# Altium project B302BA-PCIe.PrjPcb
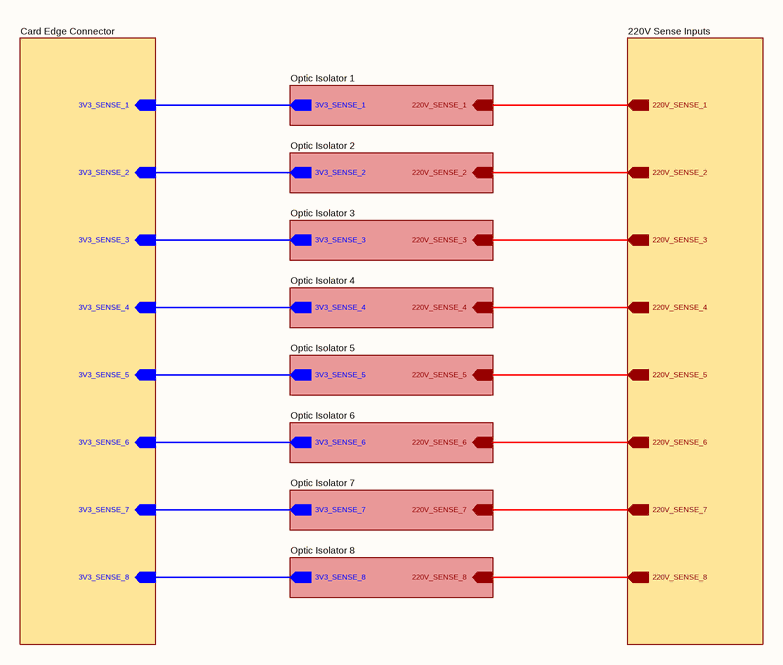
[diagram p0: Block Diagram.SchDoc]
Address1_: Buyuk Kayacik Mah. 4. OSB; Address2_: 103. Cad. No : 12; Address3_: Selcuklu / Konya; Address4_: Türkiye; Copyright_: Copyright 2022 STF Tarim (Commercial Secret); Customer_: STF Irrigation; Engineer_: Gunce Akkoyun; Git_Repo_Address_: www.github.com/akkoyun/B001AA; Module_ID_: B302AA-PCIe; Organization_: STF Res-Dev; Product_Desc_: PowerStat; Product_ID_: --; Revision_: 00.00.01; Version_: R1
11 sheets, 45 parts. Net scope: hierarchical (ports join the sheet entries above them; power ports are global).
Board file: B302BA-PCIe.PcbDoc
Sheets:
  Block Diagram.SchDoc
    Optic Isolator 1 = Opto Isolator 1.SchDoc
    Card Edge Connector = Card Edge Connector.SchDoc
    Optic Isolator 2 = Opto Isolator 2.SchDoc
    Optic Isolator 3 = Opto Isolator 3.SchDoc
    Optic Isolator 4 = Opto Isolator 4.SchDoc
    Optic Isolator 5 = Opto Isolator 5.SchDoc
    Optic Isolator 6 = Opto Isolator 6.SchDoc
    Optic Isolator 7 = Opto Isolator 7.SchDoc
    Optic Isolator 8 = Opto Isolator 8.SchDoc
  I2C IO Expander.SchDoc

## Sheet Block Diagram.SchDoc: B302AA Block Diagram
size 292 x 193 mm; SheetNumber: 1; SheetTotal: 11

### Sub-sheets
220V Sense Inputs = 220V Sense Input Socket.SchDoc (file not in this document): 220V_SENSE_2 (out), 220V_SENSE_1 (out), 220V_SENSE_5 (out), 220V_SENSE_6 (out), 220V_SENSE_3 (out), 220V_SENSE_4 (out), 220V_SENSE_7 (out), 220V_SENSE_8 (out)
Card Edge Connector = Card Edge Connector.SchDoc: 3V3_SENSE_1 (in), 3V3_SENSE_2 (in), 3V3_SENSE_3 (in), 3V3_SENSE_4 (in), 3V3_SENSE_5 (in), 3V3_SENSE_6 (in), 3V3_SENSE_8 (in), 3V3_SENSE_7 (in)
Optic Isolator 1 = Opto Isolator 1.SchDoc: 220V_SENSE_1 (in), 3V3_SENSE_1 (out)
Optic Isolator 2 = Opto Isolator 2.SchDoc: 220V_SENSE_2 (in), 3V3_SENSE_2 (out)
Optic Isolator 3 = Opto Isolator 3.SchDoc: 220V_SENSE_3 (in), 3V3_SENSE_3 (out)
Optic Isolator 4 = Opto Isolator 4.SchDoc: 220V_SENSE_4 (in), 3V3_SENSE_4 (out)
Optic Isolator 5 = Opto Isolator 5.SchDoc: 220V_SENSE_5 (in), 3V3_SENSE_5 (out)
Optic Isolator 6 = Opto Isolator 6.SchDoc: 220V_SENSE_6 (in), 3V3_SENSE_6 (out)
Optic Isolator 7 = Opto Isolator 7.SchDoc: 220V_SENSE_7 (in), 3V3_SENSE_7 (out)
Optic Isolator 8 = Opto Isolator 8.SchDoc: 220V_SENSE_8 (in), 3V3_SENSE_8 (out)

### Nets
3V3_SENSE_1: sheet Optic Isolator 1/3V3_SENSE_1, sheet Card Edge Connector/3V3_SENSE_1
3V3_SENSE_2: sheet Card Edge Connector/3V3_SENSE_2, sheet Optic Isolator 2/3V3_SENSE_2
3V3_SENSE_3: sheet Card Edge Connector/3V3_SENSE_3, sheet Optic Isolator 3/3V3_SENSE_3
3V3_SENSE_4: sheet Card Edge Connector/3V3_SENSE_4, sheet Optic Isolator 4/3V3_SENSE_4
3V3_SENSE_5: sheet Card Edge Connector/3V3_SENSE_5, sheet Optic Isolator 5/3V3_SENSE_5
3V3_SENSE_6: sheet Card Edge Connector/3V3_SENSE_6, sheet Optic Isolator 6/3V3_SENSE_6
3V3_SENSE_7: sheet Card Edge Connector/3V3_SENSE_7, sheet Optic Isolator 7/3V3_SENSE_7
3V3_SENSE_8: sheet Card Edge Connector/3V3_SENSE_8, sheet Optic Isolator 8/3V3_SENSE_8
220V_SENSE_1: sheet 220V Sense Inputs/220V_SENSE_1, sheet Optic Isolator 1/220V_SENSE_1
220V_SENSE_2: sheet 220V Sense Inputs/220V_SENSE_2, sheet Optic Isolator 2/220V_SENSE_2
220V_SENSE_3: sheet 220V Sense Inputs/220V_SENSE_3, sheet Optic Isolator 3/220V_SENSE_3
220V_SENSE_4: sheet 220V Sense Inputs/220V_SENSE_4, sheet Optic Isolator 4/220V_SENSE_4
220V_SENSE_5: sheet 220V Sense Inputs/220V_SENSE_5, sheet Optic Isolator 5/220V_SENSE_5
220V_SENSE_6: sheet 220V Sense Inputs/220V_SENSE_6, sheet Optic Isolator 6/220V_SENSE_6
220V_SENSE_7: sheet 220V Sense Inputs/220V_SENSE_7, sheet Optic Isolator 7/220V_SENSE_7
220V_SENSE_8: sheet 220V Sense Inputs/220V_SENSE_8, sheet Optic Isolator 8/220V_SENSE_8

### Notes on the sheet
- © 2021 All rights reserved.
  This document may not, in whole or in part, be copied, photocopied, reproduced, translated or converted to any electronic or machine readable from without prior written permission of Mehmet Günce Akkoyun.
  Engineer contact : akkoyun@me.com
- Property of
- Engineer :
- Date :
- Size :
- A4
- Time :
- Project :
- Page :
- /
- Customer :
- Product ID :
- Module ID :
- Version :
- File :
- Revision :

## Sheet Opto Isolator 1.SchDoc: Opto Isolator 1
size 292 x 193 mm; SheetNumber: 4; SheetTotal: 12
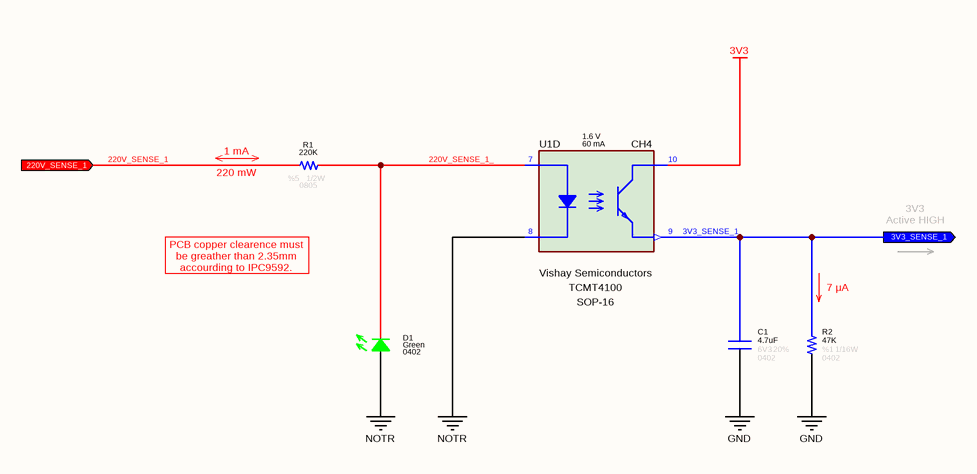
[diagram p1: Opto Isolator 1.SchDoc]

### Parts
(Parts that share a designator on the sheet are numbered #1, #2 ... from top to bottom, then left to right.)
C1  value 4.7uF  Tolerance: 20%  Case: 0402  Voltage: 6V3  [CAPACITOR_0402]  (hidden comment: Capacitor - 4.7uF [0402] (Ceramic))
D1  Case: 0402  Color: Green  [LED_0402]  (hidden comment: SMD LED (Green))
R1  value 220K  Case: 0805  Tolerance: %5  Power: 1/2W  [RESISTOR_0805]  (hidden comment: 220K - 0805 - %5 - 1/16W)
R2  value 47K  Tolerance: %1  Case: 0402  Power: 1/16W  [RESISTOR_0402]  (hidden comment: 47K - 0402 - %1 - 1/16W)
U1#1  If - Forward Current: 60 mA  Vf - Forward Voltage: 1.6 V  Manufacturer Name: Vishay Semiconductors  Case: SOP-16  [SO-16]  (hidden comment: TCMT4100)  (part D of 4)

### Ports
3V3_SENSE_1 (out), 220V_SENSE_1 (in)

### Nets
3V3: U1#1.10(Collector_CH4)
GND: C1.1 R2.1
NOTR: D1.2 U1#1.8(Cathode_CH4)
3V3_SENSE_1: C1.2 R2.2 U1#1.9(Emiter_CH4) ; port 3V3_SENSE_1
220V_SENSE_1: R1.2 ; port 220V_SENSE_1
220V_SENSE_1_: D1.1 R1.1 U1#1.7(Anode_CH4)

### Notes on the sheet
- (near R1) 1 mA
- (near R1) 220 mW
- 3V3
  Active HIGH
- PCB copper clearence must be greather than 2.35mm accourding to IPC9592.
- (near R2) 7 μA
- © 2021 All rights reserved.
  This document may not, in whole or in part, be copied, photocopied, reproduced, translated or converted to any electronic or machine readable from without prior written permission of Mehmet Günce Akkoyun.
  Engineer contact : akkoyun@me.com
- Property of
- Engineer :
- Date :
- Size :
- A4
- Time :
- Project :
- Page :
- /
- Customer :
- Product ID :
- Module ID :
- Version :
- File :
- Revision :
- (in symbol IC - TCMT4100, part D) CH4

### Library data of the parts
C1 = Capacitor - 4.7uF [0402-6V3]: Multilayer Ceramic Capacitors - SMD - 6V3 4.7uF X5R 0402 20%; Manufacturer Part Number: C0402C475M9PACTU; Manufacturer Name: KEMET
D1 = Diode - LED (0402-Green): Standard LEDs - SMD MINI-MOLD ULTRA COMPACT GREEN; Manufacturer Name: ROHM Semiconductor; Manufacturer Part Number: SML-P12MTT86R; ROHS: Yes; ComponentLink1Description: DataSheet; ComponentLink1URL: https://www.mouser.com.tr/datasheet/2/348/sml-p1-e-1139198.pdf; ComponentLink2Description: Mouser; ComponentLink2URL: https://www.mouser.com.tr/ProductDetail/ROHM-Semiconductor/SML-P12U2TT86R?qs=sGAEpiMZZMseGfSY3csMkRIBDsfU3UCXJTULB5gem9Ta%252Bp%252BvZ709fg%3D%3D
R1 = Resistor - 220K [0805]: Thick Film Resistors - SMD 1/2 W 220 KOhm 5%; Manufacturer Name: Vishay Dale; Manufacturer Part Number: CRCW0805220KJNEAHP; ComponentLink1Description: DataSheet; ComponentLink1URL: https://www.mouser.com.tr/datasheet/2/427/dcrcwe3-1762152.pdf; ComponentLink2Description: Mouser; ComponentLink2URL: https://www.mouser.com.tr/ProductDetail/Vishay-Dale/CRCW0402330RFKED?qs=sGAEpiMZZMu61qfTUdNhG2DpbjADlD3GGS6SwBlLi5Q%3D
R2 = Resistor - 47K [0402]: Thick Film Resistors - SMD 1/16 W 47 KOhm 1%; Manufacturer Name: Vishay; Manufacturer Part Number: CRCW040247K0FKED; ComponentLink1Description: DataSheet; ComponentLink1URL: https://www.mouser.com.tr/datasheet/2/427/dcrcwe3-1762152.pdf; ComponentLink2Description: Mouser; ComponentLink2URL: https://www.mouser.com.tr/ProductDetail/Vishay-Dale/CRCW040247K0FKED?qs=sGAEpiMZZMu61qfTUdNhG2DpbjADlD3GL%252B3h1elTxqU%3D
U1#1 = IC - TCMT4100: OptpCoupler 4CH 16 Pin (SOP16); Number of Channels: 4 Channel; Maximum Collector Emitter Saturation Voltage: 0.3 V; Manufacturer Part Number: TCMT4100

## Sheet Card Edge Connector.SchDoc: Card Edge Connector
size 292 x 193 mm; SheetNumber: 2; SheetTotal: 11
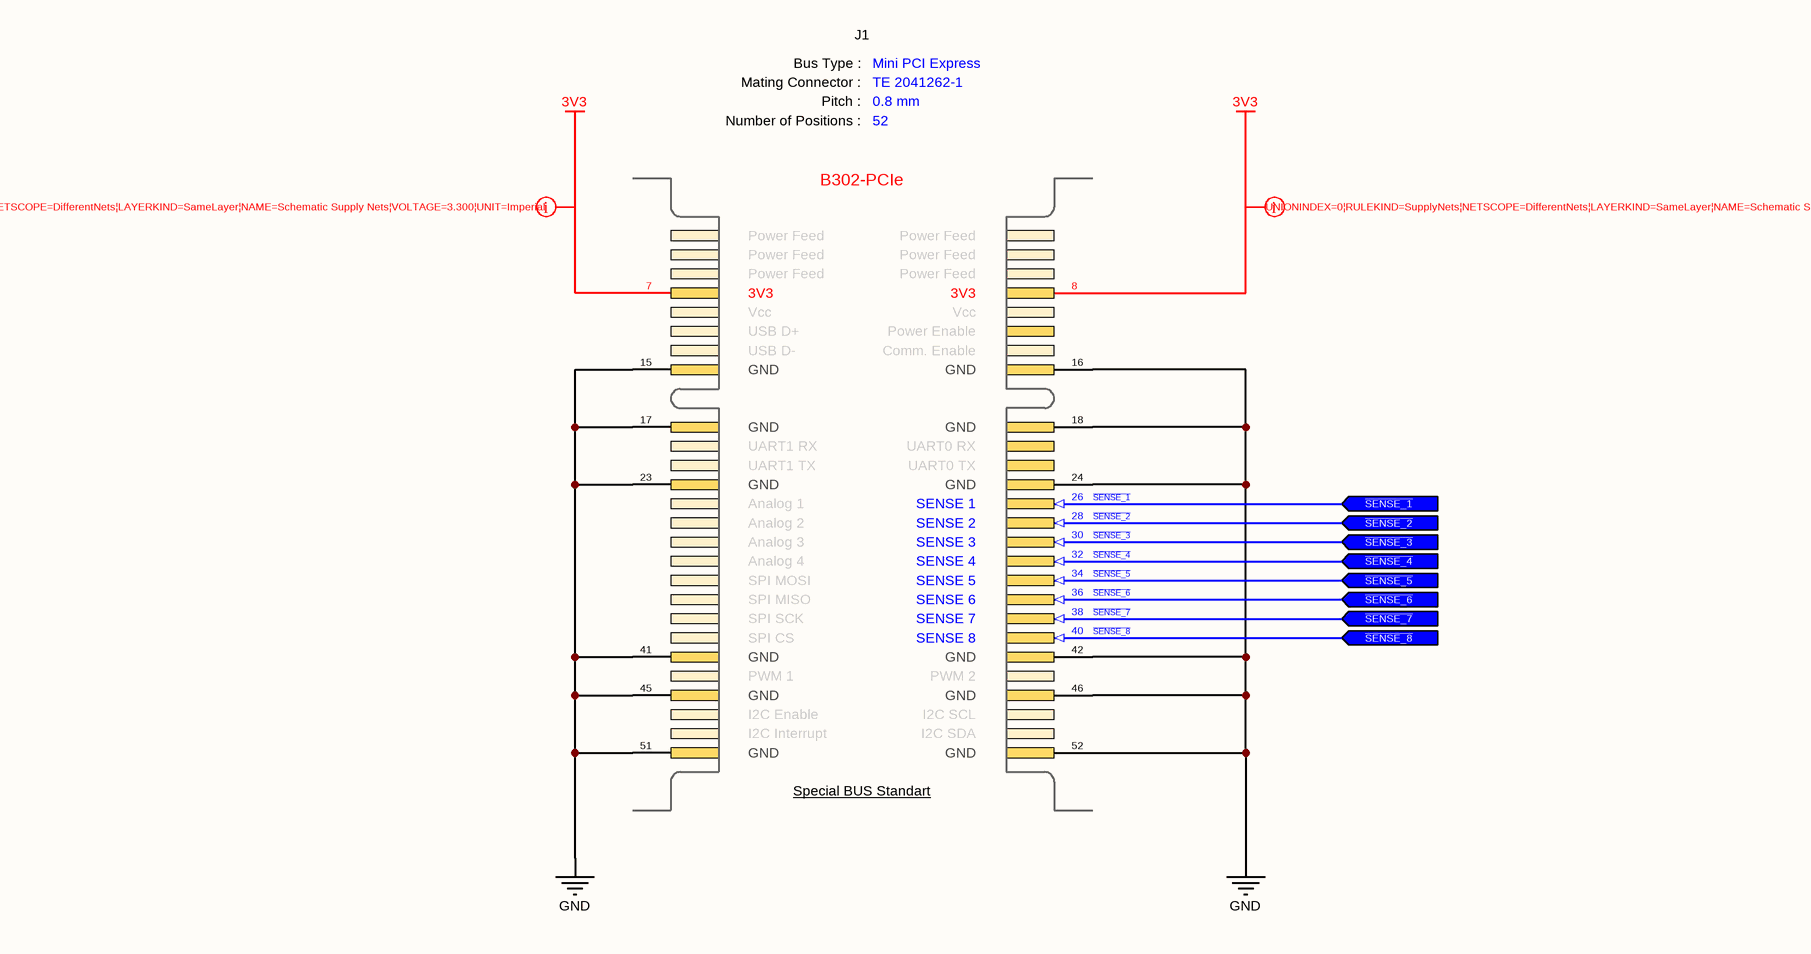
[diagram p2: Card Edge Connector.SchDoc]

### Parts
J1  BUS Type: Mini PCI Express  Mating Connector: TE 2041262-1  Pitch: 0.8 mm  Number of Positions: 52  [PCB - Mini PCI Express]  (hidden comment: Connector - Mini PCI-E (Male B302-PCIe))  (no BOM)

### Ports
~{SENSE_1} (in), ~{SENSE_2} (in), ~{SENSE_3} (in), ~{SENSE_4} (in), ~{SENSE_5} (in), ~{SENSE_6} (in), ~{SENSE_7} (in), ~{SENSE_8} (in)

### Nets
3V3: J1.7(Pin-7) J1.8(Pin-8)
GND: J1.15(Pin-15) J1.16(Pin-16) J1.17(Pin-17) J1.18(Pin-18) J1.23(Pin-23) J1.24(Pin-24) J1.41(Pin-41) J1.42(Pin-42) J1.45(Pin-45) J1.46(Pin-46) J1.51(Pin-51) J1.52(Pin-52)
~{SENSE_1}: J1.26(Pin-26) ; port ~{SENSE_1}
~{SENSE_2}: J1.28(Pin-28) ; port ~{SENSE_2}
~{SENSE_3}: J1.30(Pin-30) ; port ~{SENSE_3}
~{SENSE_4}: J1.32(Pin-32) ; port ~{SENSE_4}
~{SENSE_5}: J1.34(Pin-34) ; port ~{SENSE_5}
~{SENSE_6}: J1.36(Pin-36) ; port ~{SENSE_6}
~{SENSE_7}: J1.38(Pin-38) ; port ~{SENSE_7}
~{SENSE_8}: J1.40(Pin-40) ; port ~{SENSE_8}

### Layout directives
rule Supply Nets [Voltage = 3.300]: 3V3

### Notes on the sheet
- © 2021 All rights reserved.
  This document may not, in whole or in part, be copied, photocopied, reproduced, translated or converted to any electronic or machine readable from without prior written permission of Mehmet Günce Akkoyun.
  Engineer contact : akkoyun@me.com
- Property of
- Engineer :
- Date :
- Size :
- A4
- Time :
- Project :
- Page :
- /
- Customer :
- Product ID :
- Module ID :
- Version :
- File :
- Revision :
- (in symbol Connector - Mini PCI-E (Male B302-PCIe)) Bus Type :; Mating Connector :; Pitch :; Number of Positions :; B302-PCIe; Power Feed; 3V3; Vcc; USB D+; Power Enable; USB D-; Comm. Enable; GND; UART1 RX; UART0 RX; UART1 TX; UART0 TX; Analog 1; SENSE 1; Analog 2; SENSE 2; Analog 3; SENSE 3; Analog 4; SENSE 4; SPI MOSI; SENSE 5; SPI MISO; SENSE 6; SPI SCK; SENSE 7; SPI CS; SENSE 8; PWM 1; PWM 2; I2C Enable; I2C SCL; I2C Interrupt; I2C SDA; Special BUS Standart

### Library data of the parts
J1 = Connector - Mini PCI-E (Male B302-PCIe): Mini PCI-Express gold finger connector.; System: Connector

## Sheet Opto Isolator 2.SchDoc: Opto Isolator 2
size 292 x 193 mm; SheetNumber: 5; SheetTotal: 10
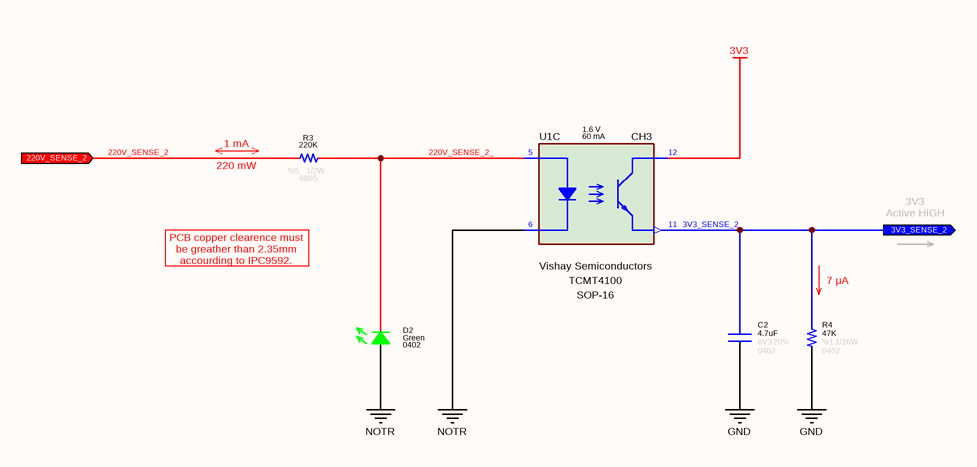
[diagram p3: Opto Isolator 2.SchDoc]

### Parts
(Parts that share a designator on the sheet are numbered #1, #2 ... from top to bottom, then left to right.)
C2  value 4.7uF  Tolerance: 20%  Case: 0402  Voltage: 6V3  [CAPACITOR_0402]  (hidden comment: Capacitor - 4.7uF [0402] (Ceramic))
D2  Case: 0402  Color: Green  [LED_0402]  (hidden comment: SMD LED (Green))
R3  value 220K  Case: 0805  Tolerance: %5  Power: 1/2W  [RESISTOR_0805]  (hidden comment: 220K - 0805 - %5 - 1/16W)
R4  value 47K  Tolerance: %1  Case: 0402  Power: 1/16W  [RESISTOR_0402]  (hidden comment: 47K - 0402 - %1 - 1/16W)
U1#1  If - Forward Current: 60 mA  Vf - Forward Voltage: 1.6 V  Manufacturer Name: Vishay Semiconductors  Case: SOP-16  [SO-16]  (hidden comment: TCMT4100)  (part C of 4)

### Ports
3V3_SENSE_2 (out), 220V_SENSE_2 (in)

### Nets
3V3: U1#1.12(Collector_CH3)
GND: C2.1 R4.1
NOTR: D2.2 U1#1.6(Cathode_CH3)
3V3_SENSE_2: C2.2 R4.2 U1#1.11(Emiter_CH3) ; port 3V3_SENSE_2
220V_SENSE_2: R3.2 ; port 220V_SENSE_2
220V_SENSE_2_: D2.1 R3.1 U1#1.5(Anode_CH3)

### Notes on the sheet
- (near R3) 1 mA
- (near R3) 220 mW
- 3V3
  Active HIGH
- PCB copper clearence must be greather than 2.35mm accourding to IPC9592.
- (near R4) 7 μA
- © 2021 All rights reserved.
  This document may not, in whole or in part, be copied, photocopied, reproduced, translated or converted to any electronic or machine readable from without prior written permission of Mehmet Günce Akkoyun.
  Engineer contact : akkoyun@me.com
- Property of
- Engineer :
- Date :
- Size :
- A4
- Time :
- Project :
- Page :
- /
- Customer :
- Product ID :
- Module ID :
- Version :
- File :
- Revision :
- (in symbol IC - TCMT4100, part C) CH3

### Library data of the parts
C2 = Capacitor - 4.7uF [0402-6V3]: as C1 on sheet Opto Isolator 1
D2 = Diode - LED (0402-Green): as D1 on sheet Opto Isolator 1; ROHS: Yes; ComponentLink1Description: DataSheet; ComponentLink1URL: https://www.mouser.com.tr/datasheet/2/348/sml-p1-e-1139198.pdf; ComponentLink2Description: Mouser; ComponentLink2URL: https://www.mouser.com.tr/ProductDetail/ROHM-Semiconductor/SML-P12U2TT86R?qs=sGAEpiMZZMseGfSY3csMkRIBDsfU3UCXJTULB5gem9Ta%252Bp%252BvZ709fg%3D%3D
R3 = Resistor - 220K [0805]: as R1 on sheet Opto Isolator 1; ComponentLink1Description: DataSheet; ComponentLink1URL: https://www.mouser.com.tr/datasheet/2/427/dcrcwe3-1762152.pdf; ComponentLink2Description: Mouser; ComponentLink2URL: https://www.mouser.com.tr/ProductDetail/Vishay-Dale/CRCW0402330RFKED?qs=sGAEpiMZZMu61qfTUdNhG2DpbjADlD3GGS6SwBlLi5Q%3D
R4 = Resistor - 47K [0402]: as R2 on sheet Opto Isolator 1; ComponentLink1Description: DataSheet; ComponentLink1URL: https://www.mouser.com.tr/datasheet/2/427/dcrcwe3-1762152.pdf; ComponentLink2Description: Mouser; ComponentLink2URL: https://www.mouser.com.tr/ProductDetail/Vishay-Dale/CRCW040247K0FKED?qs=sGAEpiMZZMu61qfTUdNhG2DpbjADlD3GL%252B3h1elTxqU%3D
U1#1 = IC - TCMT4100: as U1#1 on sheet Opto Isolator 1; Manufacturer Part Number: TCMT4100

## Sheet Opto Isolator 3.SchDoc: Opto Isolator 3
size 292 x 193 mm; SheetNumber: 6; SheetTotal: 11
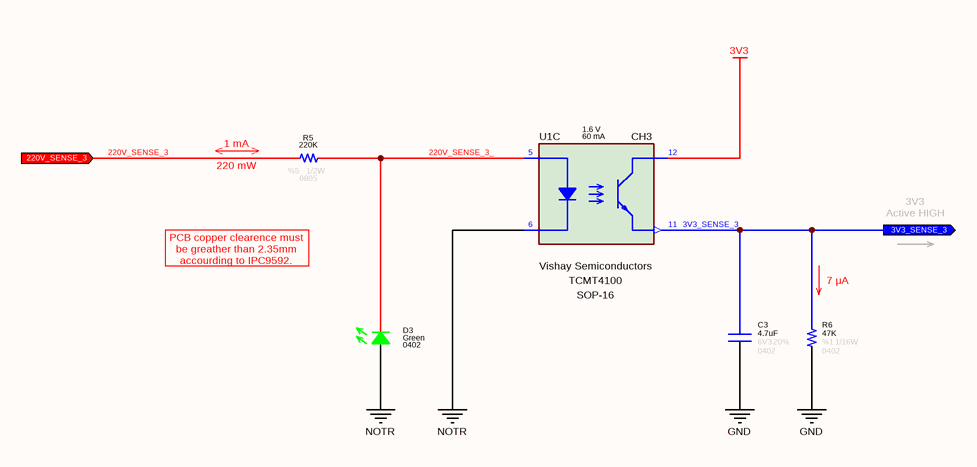
[diagram p4: Opto Isolator 3.SchDoc]

### Parts
(Parts that share a designator on the sheet are numbered #1, #2 ... from top to bottom, then left to right.)
C3  value 4.7uF  Tolerance: 20%  Case: 0402  Voltage: 6V3  [CAPACITOR_0402]  (hidden comment: Capacitor - 4.7uF [0402] (Ceramic))
D3  Case: 0402  Color: Green  [LED_0402]  (hidden comment: SMD LED (Green))
R5  value 220K  Case: 0805  Tolerance: %5  Power: 1/2W  [RESISTOR_0805]  (hidden comment: 220K - 0805 - %5 - 1/16W)
R6  value 47K  Tolerance: %1  Case: 0402  Power: 1/16W  [RESISTOR_0402]  (hidden comment: 47K - 0402 - %1 - 1/16W)
U1#2  If - Forward Current: 60 mA  Vf - Forward Voltage: 1.6 V  Manufacturer Name: Vishay Semiconductors  Case: SOP-16  [SO-16]  (hidden comment: TCMT4100)  (part C of 4)

### Ports
3V3_SENSE_3 (out), 220V_SENSE_3 (in)

### Nets
3V3: U1#2.12(Collector_CH3)
GND: C3.1 R6.1
NOTR: D3.2 U1#2.6(Cathode_CH3)
3V3_SENSE_3: C3.2 R6.2 U1#2.11(Emiter_CH3) ; port 3V3_SENSE_3
220V_SENSE_3: R5.2 ; port 220V_SENSE_3
220V_SENSE_3_: D3.1 R5.1 U1#2.5(Anode_CH3)

### Notes on the sheet
- (near R5) 1 mA
- (near R5) 220 mW
- 3V3
  Active HIGH
- PCB copper clearence must be greather than 2.35mm accourding to IPC9592.
- (near R6) 7 μA
- © 2021 All rights reserved.
  This document may not, in whole or in part, be copied, photocopied, reproduced, translated or converted to any electronic or machine readable from without prior written permission of Mehmet Günce Akkoyun.
  Engineer contact : akkoyun@me.com
- Property of
- Engineer :
- Date :
- Size :
- A4
- Time :
- Project :
- Page :
- /
- Customer :
- Product ID :
- Module ID :
- Version :
- File :
- Revision :
- (in symbol IC - TCMT4100, part C) CH3

### Library data of the parts
C3 = Capacitor - 4.7uF [0402-6V3]: as C1 on sheet Opto Isolator 1
D3 = Diode - LED (0402-Green): as D1 on sheet Opto Isolator 1; ROHS: Yes; ComponentLink1Description: DataSheet; ComponentLink1URL: https://www.mouser.com.tr/datasheet/2/348/sml-p1-e-1139198.pdf; ComponentLink2Description: Mouser; ComponentLink2URL: https://www.mouser.com.tr/ProductDetail/ROHM-Semiconductor/SML-P12U2TT86R?qs=sGAEpiMZZMseGfSY3csMkRIBDsfU3UCXJTULB5gem9Ta%252Bp%252BvZ709fg%3D%3D
R5 = Resistor - 220K [0805]: as R1 on sheet Opto Isolator 1; ComponentLink1Description: DataSheet; ComponentLink1URL: https://www.mouser.com.tr/datasheet/2/427/dcrcwe3-1762152.pdf; ComponentLink2Description: Mouser; ComponentLink2URL: https://www.mouser.com.tr/ProductDetail/Vishay-Dale/CRCW0402330RFKED?qs=sGAEpiMZZMu61qfTUdNhG2DpbjADlD3GGS6SwBlLi5Q%3D
R6 = Resistor - 47K [0402]: as R2 on sheet Opto Isolator 1; ComponentLink1Description: DataSheet; ComponentLink1URL: https://www.mouser.com.tr/datasheet/2/427/dcrcwe3-1762152.pdf; ComponentLink2Description: Mouser; ComponentLink2URL: https://www.mouser.com.tr/ProductDetail/Vishay-Dale/CRCW040247K0FKED?qs=sGAEpiMZZMu61qfTUdNhG2DpbjADlD3GL%252B3h1elTxqU%3D
U1#2 = IC - TCMT4100: as U1#1 on sheet Opto Isolator 1; Manufacturer Part Number: TCMT4100

## Sheet Opto Isolator 4.SchDoc: Opto Isolator 4
size 292 x 193 mm; SheetNumber: 7; SheetTotal: 11
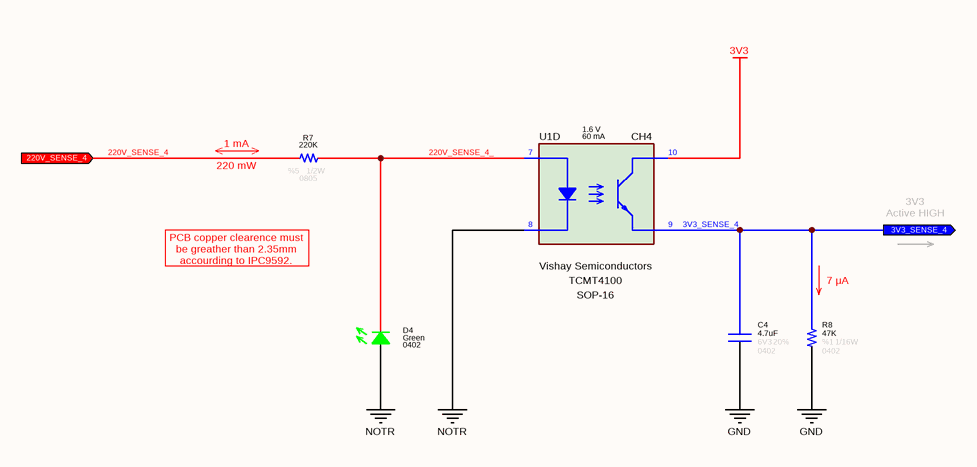
[diagram p5: Opto Isolator 4.SchDoc]

### Parts
(Parts that share a designator on the sheet are numbered #1, #2 ... from top to bottom, then left to right.)
C4  value 4.7uF  Tolerance: 20%  Case: 0402  Voltage: 6V3  [CAPACITOR_0402]  (hidden comment: Capacitor - 4.7uF [0402] (Ceramic))
D4  Case: 0402  Color: Green  [LED_0402]  (hidden comment: SMD LED (Green))
R7  value 220K  Case: 0805  Tolerance: %5  Power: 1/2W  [RESISTOR_0805]  (hidden comment: 220K - 0805 - %5 - 1/16W)
R8  value 47K  Tolerance: %1  Case: 0402  Power: 1/16W  [RESISTOR_0402]  (hidden comment: 47K - 0402 - %1 - 1/16W)
U1#2  If - Forward Current: 60 mA  Vf - Forward Voltage: 1.6 V  Manufacturer Name: Vishay Semiconductors  Case: SOP-16  [SO-16]  (hidden comment: TCMT4100)  (part D of 4)

### Ports
3V3_SENSE_4 (out), 220V_SENSE_4 (in)

### Nets
3V3: U1#2.10(Collector_CH4)
GND: C4.1 R8.1
NOTR: D4.2 U1#2.8(Cathode_CH4)
3V3_SENSE_4: C4.2 R8.2 U1#2.9(Emiter_CH4) ; port 3V3_SENSE_4
220V_SENSE_4: R7.2 ; port 220V_SENSE_4
220V_SENSE_4_: D4.1 R7.1 U1#2.7(Anode_CH4)

### Notes on the sheet
- (near R7) 1 mA
- (near R7) 220 mW
- 3V3
  Active HIGH
- PCB copper clearence must be greather than 2.35mm accourding to IPC9592.
- (near R8) 7 μA
- © 2021 All rights reserved.
  This document may not, in whole or in part, be copied, photocopied, reproduced, translated or converted to any electronic or machine readable from without prior written permission of Mehmet Günce Akkoyun.
  Engineer contact : akkoyun@me.com
- Property of
- Engineer :
- Date :
- Size :
- A4
- Time :
- Project :
- Page :
- /
- Customer :
- Product ID :
- Module ID :
- Version :
- File :
- Revision :
- (in symbol IC - TCMT4100, part D) CH4

### Library data of the parts
C4 = Capacitor - 4.7uF [0402-6V3]: as C1 on sheet Opto Isolator 1
D4 = Diode - LED (0402-Green): as D1 on sheet Opto Isolator 1; ROHS: Yes; ComponentLink1Description: DataSheet; ComponentLink1URL: https://www.mouser.com.tr/datasheet/2/348/sml-p1-e-1139198.pdf; ComponentLink2Description: Mouser; ComponentLink2URL: https://www.mouser.com.tr/ProductDetail/ROHM-Semiconductor/SML-P12U2TT86R?qs=sGAEpiMZZMseGfSY3csMkRIBDsfU3UCXJTULB5gem9Ta%252Bp%252BvZ709fg%3D%3D
R7 = Resistor - 220K [0805]: as R1 on sheet Opto Isolator 1; ComponentLink1Description: DataSheet; ComponentLink1URL: https://www.mouser.com.tr/datasheet/2/427/dcrcwe3-1762152.pdf; ComponentLink2Description: Mouser; ComponentLink2URL: https://www.mouser.com.tr/ProductDetail/Vishay-Dale/CRCW0402330RFKED?qs=sGAEpiMZZMu61qfTUdNhG2DpbjADlD3GGS6SwBlLi5Q%3D
R8 = Resistor - 47K [0402]: as R2 on sheet Opto Isolator 1; ComponentLink1Description: DataSheet; ComponentLink1URL: https://www.mouser.com.tr/datasheet/2/427/dcrcwe3-1762152.pdf; ComponentLink2Description: Mouser; ComponentLink2URL: https://www.mouser.com.tr/ProductDetail/Vishay-Dale/CRCW040247K0FKED?qs=sGAEpiMZZMu61qfTUdNhG2DpbjADlD3GL%252B3h1elTxqU%3D
U1#2 = IC - TCMT4100: as U1#1 on sheet Opto Isolator 1; Manufacturer Part Number: TCMT4100

## Sheet Opto Isolator 5.SchDoc: Opto Isolator 5
size 292 x 193 mm; SheetNumber: 8; SheetTotal: 10
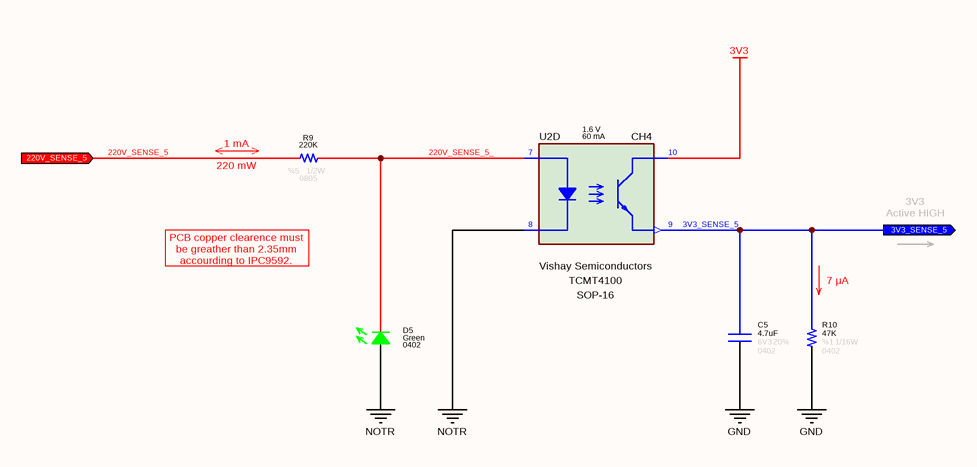
[diagram p6: Opto Isolator 5.SchDoc]

### Parts
(Parts that share a designator on the sheet are numbered #1, #2 ... from top to bottom, then left to right.)
C5  value 4.7uF  Tolerance: 20%  Case: 0402  Voltage: 6V3  [CAPACITOR_0402]  (hidden comment: Capacitor - 4.7uF [0402] (Ceramic))
D5  Case: 0402  Color: Green  [LED_0402]  (hidden comment: SMD LED (Green))
R9  value 220K  Case: 0805  Tolerance: %5  Power: 1/2W  [RESISTOR_0805]  (hidden comment: 220K - 0805 - %5 - 1/16W)
R10  value 47K  Tolerance: %1  Case: 0402  Power: 1/16W  [RESISTOR_0402]  (hidden comment: 47K - 0402 - %1 - 1/16W)
U2#1  If - Forward Current: 60 mA  Vf - Forward Voltage: 1.6 V  Manufacturer Name: Vishay Semiconductors  Case: SOP-16  [SO-16]  (hidden comment: TCMT4100)  (part D of 4)

### Ports
3V3_SENSE_5 (out), 220V_SENSE_5 (in)

### Nets
3V3: U2#1.10(Collector_CH4)
GND: C5.1 R10.1
NOTR: D5.2 U2#1.8(Cathode_CH4)
3V3_SENSE_5: C5.2 R10.2 U2#1.9(Emiter_CH4) ; port 3V3_SENSE_5
220V_SENSE_5: R9.2 ; port 220V_SENSE_5
220V_SENSE_5_: D5.1 R9.1 U2#1.7(Anode_CH4)

### Notes on the sheet
- (near R9) 1 mA
- (near R9) 220 mW
- 3V3
  Active HIGH
- PCB copper clearence must be greather than 2.35mm accourding to IPC9592.
- (near R10) 7 μA
- © 2021 All rights reserved.
  This document may not, in whole or in part, be copied, photocopied, reproduced, translated or converted to any electronic or machine readable from without prior written permission of Mehmet Günce Akkoyun.
  Engineer contact : akkoyun@me.com
- Property of
- Engineer :
- Date :
- Size :
- A4
- Time :
- Project :
- Page :
- /
- Customer :
- Product ID :
- Module ID :
- Version :
- File :
- Revision :
- (in symbol IC - TCMT4100, part D) CH4

### Library data of the parts
C5 = Capacitor - 4.7uF [0402-6V3]: as C1 on sheet Opto Isolator 1
D5 = Diode - LED (0402-Green): as D1 on sheet Opto Isolator 1; ROHS: Yes; ComponentLink1Description: DataSheet; ComponentLink1URL: https://www.mouser.com.tr/datasheet/2/348/sml-p1-e-1139198.pdf; ComponentLink2Description: Mouser; ComponentLink2URL: https://www.mouser.com.tr/ProductDetail/ROHM-Semiconductor/SML-P12U2TT86R?qs=sGAEpiMZZMseGfSY3csMkRIBDsfU3UCXJTULB5gem9Ta%252Bp%252BvZ709fg%3D%3D
R9 = Resistor - 220K [0805]: as R1 on sheet Opto Isolator 1; ComponentLink1Description: DataSheet; ComponentLink1URL: https://www.mouser.com.tr/datasheet/2/427/dcrcwe3-1762152.pdf; ComponentLink2Description: Mouser; ComponentLink2URL: https://www.mouser.com.tr/ProductDetail/Vishay-Dale/CRCW0402330RFKED?qs=sGAEpiMZZMu61qfTUdNhG2DpbjADlD3GGS6SwBlLi5Q%3D
R10 = Resistor - 47K [0402]: as R2 on sheet Opto Isolator 1; ComponentLink1Description: DataSheet; ComponentLink1URL: https://www.mouser.com.tr/datasheet/2/427/dcrcwe3-1762152.pdf; ComponentLink2Description: Mouser; ComponentLink2URL: https://www.mouser.com.tr/ProductDetail/Vishay-Dale/CRCW040247K0FKED?qs=sGAEpiMZZMu61qfTUdNhG2DpbjADlD3GL%252B3h1elTxqU%3D
U2#1 = IC - TCMT4100: as U1#1 on sheet Opto Isolator 1; Manufacturer Part Number: TCMT4100

## Sheet Opto Isolator 6.SchDoc: Opto Isolator 6
size 292 x 193 mm; SheetNumber: 9; SheetTotal: 10
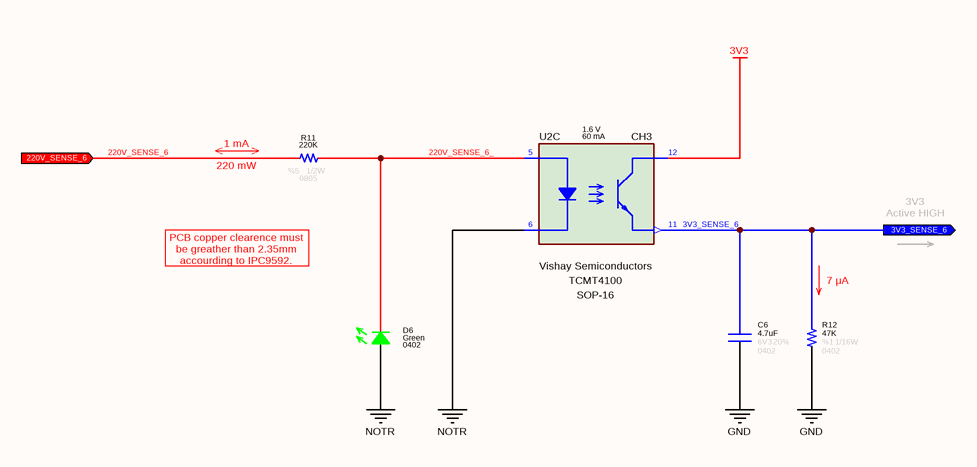
[diagram p7: Opto Isolator 6.SchDoc]

### Parts
(Parts that share a designator on the sheet are numbered #1, #2 ... from top to bottom, then left to right.)
C6  value 4.7uF  Tolerance: 20%  Case: 0402  Voltage: 6V3  [CAPACITOR_0402]  (hidden comment: Capacitor - 4.7uF [0402] (Ceramic))
D6  Case: 0402  Color: Green  [LED_0402]  (hidden comment: SMD LED (Green))
R11  value 220K  Case: 0805  Tolerance: %5  Power: 1/2W  [RESISTOR_0805]  (hidden comment: 220K - 0805 - %5 - 1/16W)
R12  value 47K  Tolerance: %1  Case: 0402  Power: 1/16W  [RESISTOR_0402]  (hidden comment: 47K - 0402 - %1 - 1/16W)
U2#1  If - Forward Current: 60 mA  Vf - Forward Voltage: 1.6 V  Manufacturer Name: Vishay Semiconductors  Case: SOP-16  [SO-16]  (hidden comment: TCMT4100)  (part C of 4)

### Ports
3V3_SENSE_6 (out), 220V_SENSE_6 (in)

### Nets
3V3: U2#1.12(Collector_CH3)
GND: C6.1 R12.1
NOTR: D6.2 U2#1.6(Cathode_CH3)
3V3_SENSE_6: C6.2 R12.2 U2#1.11(Emiter_CH3) ; port 3V3_SENSE_6
220V_SENSE_6: R11.2 ; port 220V_SENSE_6
220V_SENSE_6_: D6.1 R11.1 U2#1.5(Anode_CH3)

### Notes on the sheet
- (near R11) 1 mA
- (near R11) 220 mW
- 3V3
  Active HIGH
- PCB copper clearence must be greather than 2.35mm accourding to IPC9592.
- (near R12) 7 μA
- © 2021 All rights reserved.
  This document may not, in whole or in part, be copied, photocopied, reproduced, translated or converted to any electronic or machine readable from without prior written permission of Mehmet Günce Akkoyun.
  Engineer contact : akkoyun@me.com
- Property of
- Engineer :
- Date :
- Size :
- A4
- Time :
- Project :
- Page :
- /
- Customer :
- Product ID :
- Module ID :
- Version :
- File :
- Revision :
- (in symbol IC - TCMT4100, part C) CH3

### Library data of the parts
C6 = Capacitor - 4.7uF [0402-6V3]: as C1 on sheet Opto Isolator 1
D6 = Diode - LED (0402-Green): as D1 on sheet Opto Isolator 1; ROHS: Yes; ComponentLink1Description: DataSheet; ComponentLink1URL: https://www.mouser.com.tr/datasheet/2/348/sml-p1-e-1139198.pdf; ComponentLink2Description: Mouser; ComponentLink2URL: https://www.mouser.com.tr/ProductDetail/ROHM-Semiconductor/SML-P12U2TT86R?qs=sGAEpiMZZMseGfSY3csMkRIBDsfU3UCXJTULB5gem9Ta%252Bp%252BvZ709fg%3D%3D
R11 = Resistor - 220K [0805]: as R1 on sheet Opto Isolator 1; ComponentLink1Description: DataSheet; ComponentLink1URL: https://www.mouser.com.tr/datasheet/2/427/dcrcwe3-1762152.pdf; ComponentLink2Description: Mouser; ComponentLink2URL: https://www.mouser.com.tr/ProductDetail/Vishay-Dale/CRCW0402330RFKED?qs=sGAEpiMZZMu61qfTUdNhG2DpbjADlD3GGS6SwBlLi5Q%3D
R12 = Resistor - 47K [0402]: as R2 on sheet Opto Isolator 1; ComponentLink1Description: DataSheet; ComponentLink1URL: https://www.mouser.com.tr/datasheet/2/427/dcrcwe3-1762152.pdf; ComponentLink2Description: Mouser; ComponentLink2URL: https://www.mouser.com.tr/ProductDetail/Vishay-Dale/CRCW040247K0FKED?qs=sGAEpiMZZMu61qfTUdNhG2DpbjADlD3GL%252B3h1elTxqU%3D
U2#1 = IC - TCMT4100: as U1#1 on sheet Opto Isolator 1; Manufacturer Part Number: TCMT4100

## Sheet Opto Isolator 7.SchDoc: Opto Isolator 7
size 292 x 193 mm; SheetNumber: 10; SheetTotal: 10
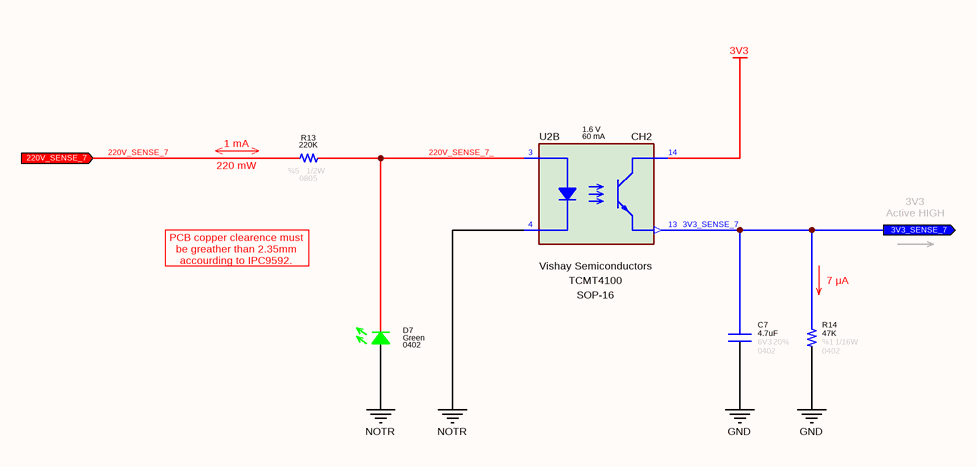
[diagram p8: Opto Isolator 7.SchDoc]

### Parts
(Parts that share a designator on the sheet are numbered #1, #2 ... from top to bottom, then left to right.)
C7  value 4.7uF  Tolerance: 20%  Case: 0402  Voltage: 6V3  [CAPACITOR_0402]  (hidden comment: Capacitor - 4.7uF [0402] (Ceramic))
D7  Case: 0402  Color: Green  [LED_0402]  (hidden comment: SMD LED (Green))
R13  value 220K  Case: 0805  Tolerance: %5  Power: 1/2W  [RESISTOR_0805]  (hidden comment: 220K - 0805 - %5 - 1/16W)
R14  value 47K  Tolerance: %1  Case: 0402  Power: 1/16W  [RESISTOR_0402]  (hidden comment: 47K - 0402 - %1 - 1/16W)
U2#1  If - Forward Current: 60 mA  Vf - Forward Voltage: 1.6 V  Manufacturer Name: Vishay Semiconductors  Case: SOP-16  [SO-16]  (hidden comment: TCMT4100)  (part B of 4)

### Ports
3V3_SENSE_7 (out), 220V_SENSE_7 (in)

### Nets
3V3: U2#1.14(Collector_CH2)
GND: C7.1 R14.1
NOTR: D7.2 U2#1.4(Cathode_CH2)
3V3_SENSE_7: C7.2 R14.2 U2#1.13(Emiter_CH2) ; port 3V3_SENSE_7
220V_SENSE_7: R13.2 ; port 220V_SENSE_7
220V_SENSE_7_: D7.1 R13.1 U2#1.3(Anode_CH2)

### Notes on the sheet
- (near R13) 1 mA
- (near R13) 220 mW
- 3V3
  Active HIGH
- PCB copper clearence must be greather than 2.35mm accourding to IPC9592.
- (near R14) 7 μA
- © 2021 All rights reserved.
  This document may not, in whole or in part, be copied, photocopied, reproduced, translated or converted to any electronic or machine readable from without prior written permission of Mehmet Günce Akkoyun.
  Engineer contact : akkoyun@me.com
- Property of
- Engineer :
- Date :
- Size :
- A4
- Time :
- Project :
- Page :
- /
- Customer :
- Product ID :
- Module ID :
- Version :
- File :
- Revision :
- (in symbol IC - TCMT4100, part B) CH2

### Library data of the parts
C7 = Capacitor - 4.7uF [0402-6V3]: as C1 on sheet Opto Isolator 1
D7 = Diode - LED (0402-Green): as D1 on sheet Opto Isolator 1; ROHS: Yes; ComponentLink1Description: DataSheet; ComponentLink1URL: https://www.mouser.com.tr/datasheet/2/348/sml-p1-e-1139198.pdf; ComponentLink2Description: Mouser; ComponentLink2URL: https://www.mouser.com.tr/ProductDetail/ROHM-Semiconductor/SML-P12U2TT86R?qs=sGAEpiMZZMseGfSY3csMkRIBDsfU3UCXJTULB5gem9Ta%252Bp%252BvZ709fg%3D%3D
R13 = Resistor - 220K [0805]: as R1 on sheet Opto Isolator 1; ComponentLink1Description: DataSheet; ComponentLink1URL: https://www.mouser.com.tr/datasheet/2/427/dcrcwe3-1762152.pdf; ComponentLink2Description: Mouser; ComponentLink2URL: https://www.mouser.com.tr/ProductDetail/Vishay-Dale/CRCW0402330RFKED?qs=sGAEpiMZZMu61qfTUdNhG2DpbjADlD3GGS6SwBlLi5Q%3D
R14 = Resistor - 47K [0402]: as R2 on sheet Opto Isolator 1; ComponentLink1Description: DataSheet; ComponentLink1URL: https://www.mouser.com.tr/datasheet/2/427/dcrcwe3-1762152.pdf; ComponentLink2Description: Mouser; ComponentLink2URL: https://www.mouser.com.tr/ProductDetail/Vishay-Dale/CRCW040247K0FKED?qs=sGAEpiMZZMu61qfTUdNhG2DpbjADlD3GL%252B3h1elTxqU%3D
U2#1 = IC - TCMT4100: as U1#1 on sheet Opto Isolator 1; Manufacturer Part Number: TCMT4100

## Sheet Opto Isolator 8.SchDoc: Opto Isolator 8
size 292 x 193 mm; SheetNumber: 11; SheetTotal: 11
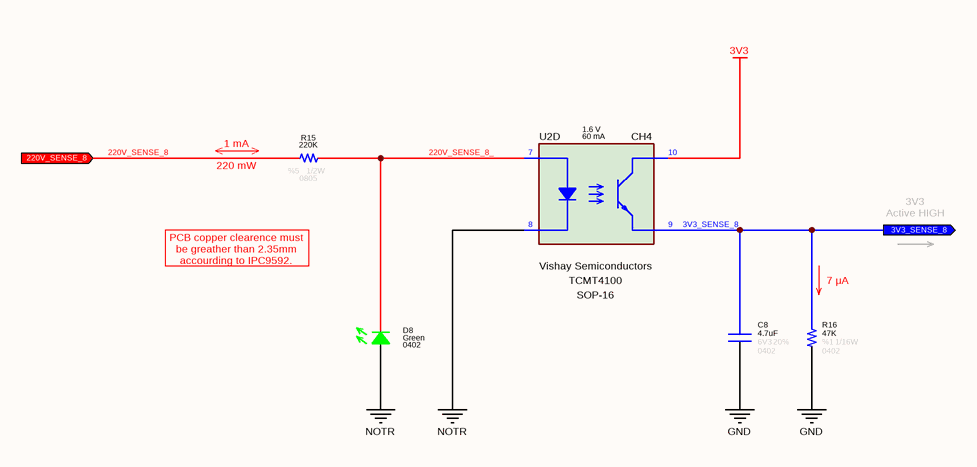
[diagram p9: Opto Isolator 8.SchDoc]

### Parts
(Parts that share a designator on the sheet are numbered #1, #2 ... from top to bottom, then left to right.)
C8  value 4.7uF  Tolerance: 20%  Case: 0402  Voltage: 6V3  [CAPACITOR_0402]  (hidden comment: Capacitor - 4.7uF [0402] (Ceramic))
D8  Case: 0402  Color: Green  [LED_0402]  (hidden comment: SMD LED (Green))
R15  value 220K  Case: 0805  Tolerance: %5  Power: 1/2W  [RESISTOR_0805]  (hidden comment: 220K - 0805 - %5 - 1/16W)
R16  value 47K  Tolerance: %1  Case: 0402  Power: 1/16W  [RESISTOR_0402]  (hidden comment: 47K - 0402 - %1 - 1/16W)
U2#2  If - Forward Current: 60 mA  Vf - Forward Voltage: 1.6 V  Manufacturer Name: Vishay Semiconductors  Case: SOP-16  [SO-16]  (hidden comment: TCMT4100)  (part D of 4)

### Ports
3V3_SENSE_8 (out), 220V_SENSE_8 (in)

### Nets
3V3: U2#2.10(Collector_CH4)
GND: C8.1 R16.1
NOTR: D8.2 U2#2.8(Cathode_CH4)
3V3_SENSE_8: C8.2 R16.2 U2#2.9(Emiter_CH4) ; port 3V3_SENSE_8
220V_SENSE_8: R15.2 ; port 220V_SENSE_8
220V_SENSE_8_: D8.1 R15.1 U2#2.7(Anode_CH4)

### Notes on the sheet
- (near R15) 1 mA
- (near R15) 220 mW
- 3V3
  Active HIGH
- PCB copper clearence must be greather than 2.35mm accourding to IPC9592.
- (near R16) 7 μA
- © 2021 All rights reserved.
  This document may not, in whole or in part, be copied, photocopied, reproduced, translated or converted to any electronic or machine readable from without prior written permission of Mehmet Günce Akkoyun.
  Engineer contact : akkoyun@me.com
- Property of
- Engineer :
- Date :
- Size :
- A4
- Time :
- Project :
- Page :
- /
- Customer :
- Product ID :
- Module ID :
- Version :
- File :
- Revision :
- (in symbol IC - TCMT4100, part D) CH4

### Library data of the parts
C8 = Capacitor - 4.7uF [0402-6V3]: as C1 on sheet Opto Isolator 1
D8 = Diode - LED (0402-Green): as D1 on sheet Opto Isolator 1; ROHS: Yes; ComponentLink1Description: DataSheet; ComponentLink1URL: https://www.mouser.com.tr/datasheet/2/348/sml-p1-e-1139198.pdf; ComponentLink2Description: Mouser; ComponentLink2URL: https://www.mouser.com.tr/ProductDetail/ROHM-Semiconductor/SML-P12U2TT86R?qs=sGAEpiMZZMseGfSY3csMkRIBDsfU3UCXJTULB5gem9Ta%252Bp%252BvZ709fg%3D%3D
R15 = Resistor - 220K [0805]: as R1 on sheet Opto Isolator 1; ComponentLink1Description: DataSheet; ComponentLink1URL: https://www.mouser.com.tr/datasheet/2/427/dcrcwe3-1762152.pdf; ComponentLink2Description: Mouser; ComponentLink2URL: https://www.mouser.com.tr/ProductDetail/Vishay-Dale/CRCW0402330RFKED?qs=sGAEpiMZZMu61qfTUdNhG2DpbjADlD3GGS6SwBlLi5Q%3D
R16 = Resistor - 47K [0402]: as R2 on sheet Opto Isolator 1; ComponentLink1Description: DataSheet; ComponentLink1URL: https://www.mouser.com.tr/datasheet/2/427/dcrcwe3-1762152.pdf; ComponentLink2Description: Mouser; ComponentLink2URL: https://www.mouser.com.tr/ProductDetail/Vishay-Dale/CRCW040247K0FKED?qs=sGAEpiMZZMu61qfTUdNhG2DpbjADlD3GL%252B3h1elTxqU%3D
U2#2 = IC - TCMT4100: as U1#1 on sheet Opto Isolator 1; Manufacturer Part Number: TCMT4100

## Sheet I2C IO Expander.SchDoc: I2C I/O Expander
size 292 x 193 mm; SheetNumber: 3; SheetTotal: 11
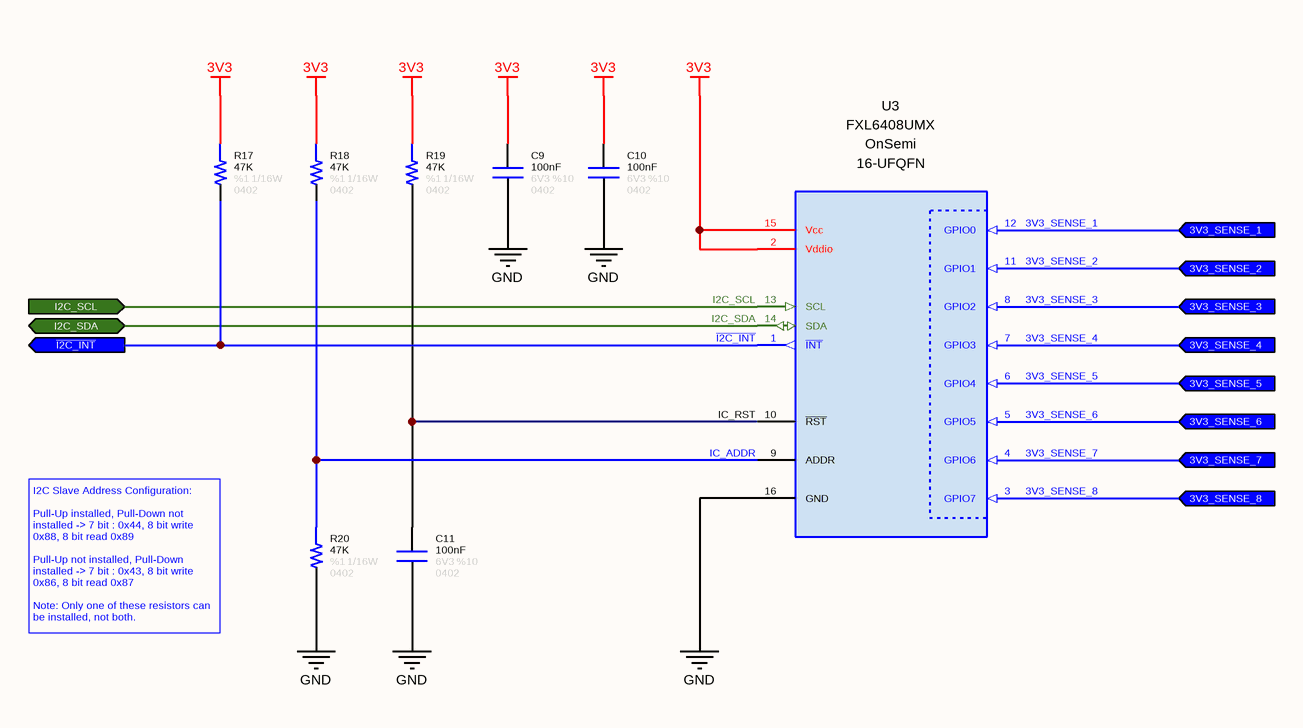
[diagram p10: I2C IO Expander.SchDoc]

### Parts
C9  value 100nF  Tolerance: %10  Voltage: 6V3  Case: 0402  [CAPACITOR_0402]  (hidden comment: Capacitor - 100nF [0402] (Ceramic))
C10  value 100nF  Tolerance: %10  Voltage: 6V3  Case: 0402  [CAPACITOR_0402]  (hidden comment: Capacitor - 100nF [0402] (Ceramic))
C11  value 100nF  Tolerance: %10  Voltage: 6V3  Case: 0402  [CAPACITOR_0402]  (hidden comment: Capacitor - 100nF [0402] (Ceramic))
R17  value 47K  Tolerance: %1  Case: 0402  Power: 1/16W  [RESISTOR_0402]  (hidden comment: 47K - 0402 - %1 - 1/16W)
R18  value 47K  Tolerance: %1  Case: 0402  Power: 1/16W  [RESISTOR_0402]  (hidden comment: 47K - 0402 - %1 - 1/16W)
R19  value 47K  Tolerance: %1  Case: 0402  Power: 1/16W  [RESISTOR_0402]  (hidden comment: 47K - 0402 - %1 - 1/16W)
R20  value 47K  Tolerance: %1  Case: 0402  Power: 1/16W  [RESISTOR_0402]  (hidden comment: 47K - 0402 - %1 - 1/16W)
U3  Manufacturer Part Number: OnSemi  [16-UFQFN]  (hidden comment: FXL6408UMX)

### Ports
3V3_SENSE_1 (in), 3V3_SENSE_2 (in), 3V3_SENSE_3 (in), 3V3_SENSE_4 (in), 3V3_SENSE_5 (in), 3V3_SENSE_6 (in), 3V3_SENSE_7 (in), 3V3_SENSE_8 (in), I2C_SCL (in), I2C_SDA (bidir), ~{I2C_INT} (out)

### Nets
3V3: C9.2 C10.2 R17.2 R18.2 R19.2 U3.2(Vddio) U3.15(Vcc)
GND: C9.1 C10.1 C11.1 R20.1 U3.16(GND)
3V3_SENSE_1: U3.12(GPIO0) ; port 3V3_SENSE_1
3V3_SENSE_2: U3.11(GPIO1) ; port 3V3_SENSE_2
3V3_SENSE_3: U3.8(GPIO2) ; port 3V3_SENSE_3
3V3_SENSE_4: U3.7(GPIO3) ; port 3V3_SENSE_4
3V3_SENSE_5: U3.6(GPIO4) ; port 3V3_SENSE_5
3V3_SENSE_6: U3.5(GPIO5) ; port 3V3_SENSE_6
3V3_SENSE_7: U3.4(GPIO6) ; port 3V3_SENSE_7
3V3_SENSE_8: U3.3(GPIO7) ; port 3V3_SENSE_8
I2C_SCL: U3.13(SCL) ; port I2C_SCL
I2C_SDA: U3.14(SDA) ; port I2C_SDA
~{I2C_INT}: R17.1 U3.1(~{INT}) ; port ~{I2C_INT}
IC_ADDR: R18.1 R20.2 U3.9(ADDR)
IC_RST: C11.2 R19.1 U3.10(~{RST})

### Notes on the sheet
- I2C Slave Address Configuration:
  Pull-Up installed, Pull-Down not installed -> 7 bit : 0x44, 8 bit write 0x88, 8 bit read 0x89
  Pull-Up not installed, Pull-Down installed -> 7 bit : 0x43, 8 bit write 0x86, 8 bit read 0x87
  Note: Only one of these resistors can be installed, not both.
- © 2021 All rights reserved.
  This document may not, in whole or in part, be copied, photocopied, reproduced, translated or converted to any electronic or machine readable from without prior written permission of Mehmet Günce Akkoyun.
  Engineer contact : akkoyun@me.com
- Property of
- Engineer :
- Date :
- Size :
- A4
- Time :
- Project :
- Page :
- /
- Customer :
- Product ID :
- Module ID :
- Version :
- File :
- Revision :

### Library data of the parts
C9-C11 = Capacitor - 100nF [0402-6V3]: Capacitor - 100nF [0402-6V3] (Ceramic); Manufacturer Name: AVX; Manufacturer Part Number: 04026D104KAT4A; ComponentLink1Description: Mouser; ComponentLink1URL: https://www.mouser.com.tr/ProductDetail/AVX/04026D104KAT4A?qs=sGAEpiMZZMs0AnBnWHyRQPg4iYkCw7IMED%2F4kpqgf7w%3D; ComponentLink2Description: DataSheet; ComponentLink2URL: https://www.mouser.com.tr/datasheet/2/40/cx5r-776519.pdf
R17-R20 = Resistor - 47K [0402]: as R2 on sheet Opto Isolator 1; ComponentLink1Description: DataSheet; ComponentLink1URL: https://www.mouser.com.tr/datasheet/2/427/dcrcwe3-1762152.pdf; ComponentLink2Description: Mouser; ComponentLink2URL: https://www.mouser.com.tr/ProductDetail/Vishay-Dale/CRCW040247K0FKED?qs=sGAEpiMZZMu61qfTUdNhG2DpbjADlD3GL%252B3h1elTxqU%3D
U3 = IC - FXL6408UMX: IC GPIO EXPANDER I2C 8B 16-UMLP; Product Type: I/O Expanders; Manufacturer Name: FXL6408UMX; Case: 16-UFQFN

## Nets that join several sheets
3V3: Opto Isolator 1 (U1#1.10), Card Edge Connector (J1.7 J1.8), Opto Isolator 2 (U1#1.12), Opto Isolator 3 (U1#2.12), Opto Isolator 4 (U1#2.10), Opto Isolator 5 (U2#1.10), Opto Isolator 6 (U2#1.12), Opto Isolator 7 (U2#1.14), Opto Isolator 8 (U2#2.10), I2C IO Expander (7 pins)
GND: Opto Isolator 1 (C1.1 R2.1), Card Edge Connector (12 pins), Opto Isolator 2 (C2.1 R4.1), Opto Isolator 3 (C3.1 R6.1), Opto Isolator 4 (C4.1 R8.1), Opto Isolator 5 (C5.1 R10.1), Opto Isolator 6 (C6.1 R12.1), Opto Isolator 7 (C7.1 R14.1), Opto Isolator 8 (C8.1 R16.1), I2C IO Expander (5 pins)
NOTR: Opto Isolator 1 (D1.2 U1#1.8), Opto Isolator 2 (D2.2 U1#1.6), Opto Isolator 3 (D3.2 U1#2.6), Opto Isolator 4 (D4.2 U1#2.8), Opto Isolator 5 (D5.2 U2#1.8), Opto Isolator 6 (D6.2 U2#1.6), Opto Isolator 7 (D7.2 U2#1.4), Opto Isolator 8 (D8.2 U2#2.8)

## Assembly variants
Board Mounth: not fitted J1